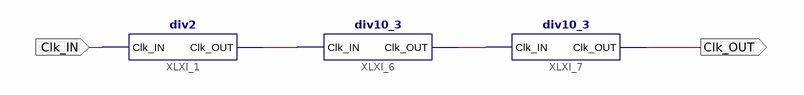
[diagram p0: schematic sheet 1]
// Xilinx ISE schematic ClkForSeven.sch (spartan6) as structural Verilog: 3 symbols, 2 ports
module ClkForSeven (
  input  Clk_IN,
  output Clk_OUT
);

  wire XLXN_3, XLXN_4;

  div2 XLXI_1 (.Clk_IN(Clk_IN), .Clk_OUT(XLXN_3));
  div10_3 XLXI_6 (.Clk_IN(XLXN_3), .Clk_OUT(XLXN_4));
  div10_3 XLXI_7 (.Clk_IN(XLXN_4), .Clk_OUT(Clk_OUT));
endmodule
